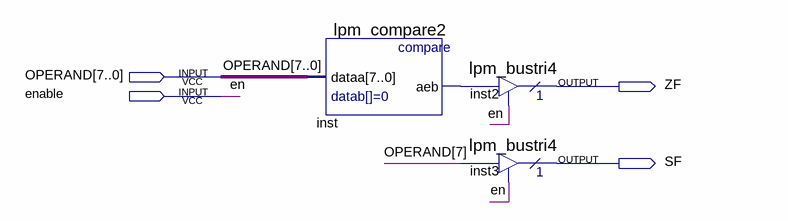
[diagram p0: schematic sheet]
// Quartus schematic FR.bdf as structural Verilog: 3 symbols, 4 pins
module FR (
  input  [7:0] OPERAND,
  input  enable,
  output ZF,
  output SF
);

  wire inst_aeb;

  lpm_compare2 inst (.dataa(OPERAND), .aeb(inst_aeb));
  lpm_bustri4 inst2 (.enabledt(enable), .data(inst_aeb), .tridata(ZF));
  lpm_bustri4 inst3 (.enabledt(enable), .data(OPERAND[7]), .tridata(SF));

  // Other names for the same wires on the sheet: en = enable
endmodule
